# EAGLE design m_knife_1 (EAGLE 7.7.0)
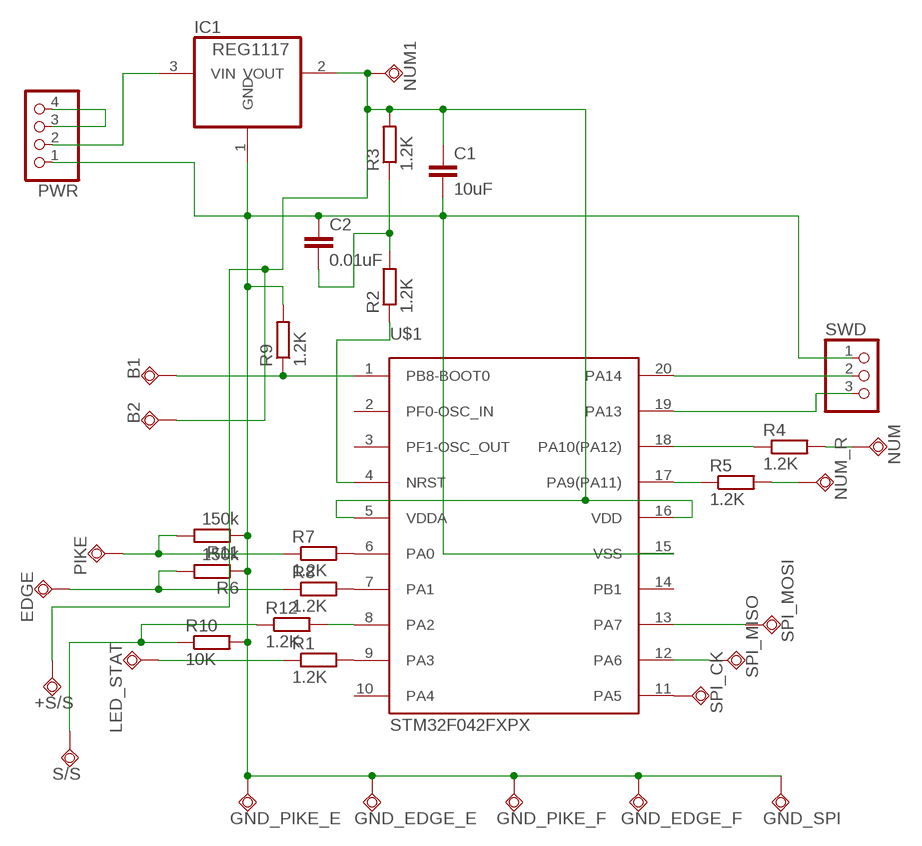
[diagram p0: schematic, sheet 1]

## Parts
+S/S  TPSQTP20R  [TP20R]
B1  TPSQTP20R  [TP20R]
B2  TPSQTP20R  [TP20R]
C1  10uF  C-EUC0805  [C0805]
C2  0.01uF  C-EUC0805  [C0805]
EDGE  TPSQTP20R  [TP20R]
GND_EDGE_E  TPSQTP20R  [TP20R]
GND_EDGE_F  TPSQTP20R  [TP20R]
GND_PIKE_E  TPSQTP20R  [TP20R]
GND_PIKE_F  TPSQTP20R  [TP20R]
GND_SPI  TPSQTP20R  [TP20R]
IC1  REG1117  [SOT223]
LED_STAT  TPSQTP20R  [TP20R]
NUM  TPSQTP20R  [TP20R]
NUM1  TPSQTP20R  [TP20R]
NUM_R  TPSQTP20R  [TP20R]
PIKE  TPSQTP20R  [TP20R]
PWR  PINHD-1X4  [1X04]
R1  1.2K  R-EU_R0805  [R0805]
R2  1.2K  R-EU_R0805  [R0805]
R3  1.2K  R-EU_R0805  [R0805]
R4  1.2K  R-EU_R0805  [R0805]
R5  1.2K  R-EU_R0805  [R0805]
R6  150k  R-EU_R0805  [R0805]
R7  1.2K  R-EU_R0805  [R0805]
R8  1.2K  R-EU_R0805  [R0805]
R9  1.2K  R-EU_R0805  [R0805]
R10  10K  R-EU_R0805  [R0805]
R11  150k  R-EU_R0805  [R0805]
R12  1.2K  R-EU_R0805  [R0805]
S/S  TPSQTP20R  [TP20R]
SPI_CK  TPSQTP20R  [TP20R]
SPI_MISO  TPSQTP20R  [TP20R]
SPI_MOSI  TPSQTP20R  [TP20R]
SWD  PINHD-1X3  [1X03]
U$1  STM32F042FXPX  [TSSOP20]

## Nets
N$1: R7.2 U$1.6(PA0)
N$2: R8.2 U$1.7(PA1)
N$3: R1.2 U$1.9(PA3)
N$4: SPI_CK.TP U$1.11(PA5)
N$5: SPI_MISO.TP U$1.12(PA6)
N$6: SPI_MOSI.TP U$1.13(PA7)
N$7: R4.1 U$1.18(PA10(PA12))
N$8: R12.2 U$1.8(PA2)
N$9: NUM_R.TP R5.2
N$10: R10.1 R12.1 S/S.TP
N$11: R2.1 U$1.4(NRST)
N$12: B1.TP R9.1 U$1.1(PB8-BOOT0)
N$13: LED_STAT.TP R1.1
N$14: C1.2 C2.1 GND_EDGE_E.TP GND_EDGE_F.TP GND_PIKE_E.TP GND_PIKE_F.TP GND_SPI.TP IC1.1(GND) PWR.1 R6.1 R9.2 R10.2 R11.1 SWD.1 U$1.15(VSS)
N$15: PWR.3 PWR.4
N$16: IC1.3(VIN) PWR.2
N$18: NUM.TP R4.2
N$19: SWD.2 U$1.20(PA14)
N$20: SWD.3 U$1.19(PA13)
N$21: C2.2 R2.2 R3.1
N$22: R5.1 U$1.17(PA9(PA11))
N$24: PIKE.TP R7.1 R11.2
N$25: EDGE.TP R6.2 R8.1
N$27: +S/S.TP B2.TP C1.1 IC1.2(VOUT) NUM1.TP R3.2 U$1.5(VDDA) U$1.16(VDD)
Unconnected: U$1.2(PF0-OSC_IN) U$1.3(PF1-OSC_OUT) U$1.10(PA4) U$1.14(PB1)

## Library data of the parts
+S/S B1 B2 EDGE GND_EDGE_E GND_EDGE_F GND_PIKE_E GND_PIKE_F GND_SPI LED_STAT NUM NUM1 NUM_R PIKE S/S SPI_CK SPI_MISO SPI_MOSI = testpad:TPSQ: Test pad
C1 C2 = rcl:C-EU: CAPACITOR, European symbol
IC1 = burr-brown:REG1117: 800mA and 1A Low Dropout (LDO) Positive Regulator 1.8V, 2.5V, 2.85V, 3.3V, 5V, and Adj; MPN: REG1117; OC_FARNELL: 1097566; OC_NEWARK: 14P6981
PWR = pinhead:PINHD-1X4: PIN HEADER
R1-R12 = resistor:R-EU_: RESISTOR, European symbol
SWD = pinhead:PINHD-1X3: PIN HEADER
U$1 = stm32f0:STM32F042FXPX

## Board
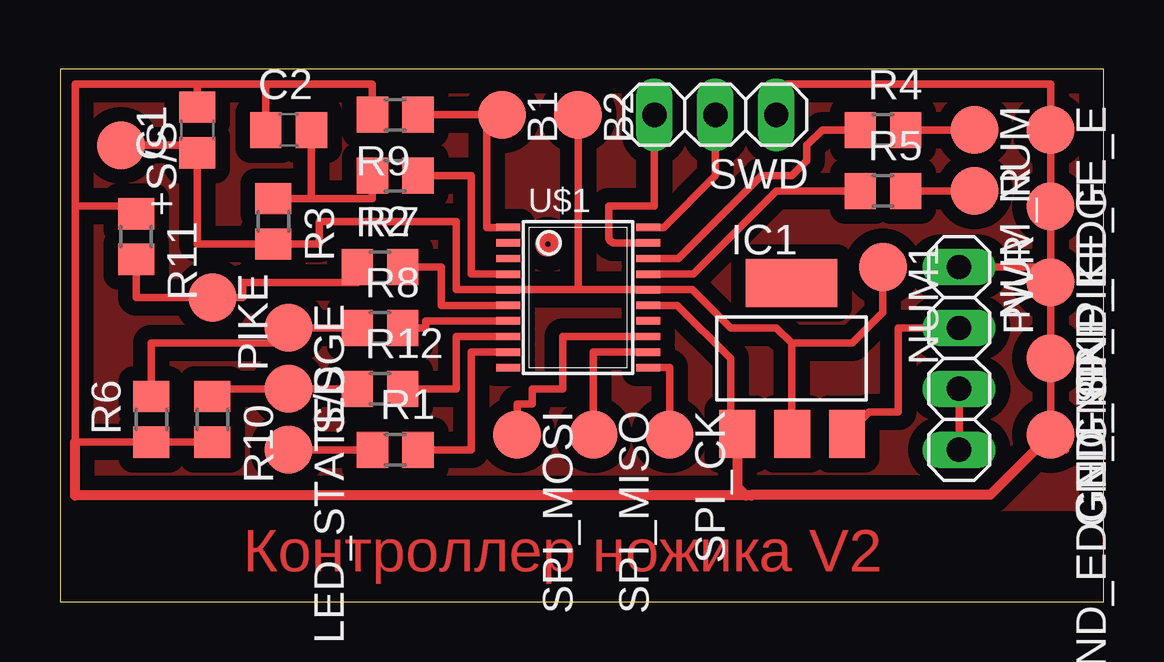
[diagram p1: board, top side]

Size 43.48 x 22.21 mm. Coordinates in mm from the lower left corner, seen from the top.
Outline: 0,22.21 0,0 43.48,0 43.48,22.21 0,22.21
Copper layers (1*16): Top 0.035mm / dielectric 1.5mm / Bottom 0.035mm
Design rules "default *": minimum track width 10mil, minimum drill 24mil, track to track 8mil, track to pad 8mil, pad to pad 8mil, via to via 8mil, smd to smd 8mil, copper to edge 40mil, drill to drill 8mil, minimum pad ring 10mil, minimum via ring 8mil, stop-mask expansion 4mil, vias tented up to drill 0mil, thermal gap 10mil

### Footprints (pad centres in the part's own frame; a part is rotated, then mirrored left to right if it is on the bottom)
TP20R = smd 2 x 2: TP 0,0
C0805 = smd 1.3 x 1.5: 1 -0.95,0; 2 0.95,0
SOT223 = smd 1.499 x 2.007: 1 -2.261,-3.15; 2 0.025,-3.15; 3 2.311,-3.15 | smd 3.81 x 2.007: 4 0,3.15
1X04 = drill 1.016 long: 1 -3.81,0; 2 -1.27,0; 3 1.27,0; 4 3.81,0
R0805 = smd 1.3 x 1.5: 1 -0.95,0; 2 0.95,0
1X03 = drill 1.016 long: 1 -2.54,0; 2 0,0; 3 2.54,0
TSSOP20 = smd 0.305 x 0.991: 1 -2.925,-2.918; 2 -2.275,-2.918; 3 -1.625,-2.918; 4 -0.975,-2.918; 5 -0.325,-2.918; 6 0.325,-2.918; 7 0.975,-2.918; 8 1.625,-2.918; 9 2.275,-2.918; 10 2.925,-2.918; 11 2.925,2.918; 12 2.275,2.918; 13 1.625,2.918; 14 0.975,2.918; 15 0.325,2.918; 16 -0.325,2.918; 17 -0.975,2.918; 18 -1.625,2.918; 19 -2.275,2.918; 20 -2.925,2.918

### Placement (x,y rotation side)
+S/S  2.54,19.03 270 top
B1  18.41,20.3 270 top
B2  21.59,20.3 270 top
C1  5.71,19.66 90 top
C2  9.53,19.66 0 top
EDGE  9.53,11.41 270 top
GND_EDGE_E  41.27,19.66 270 top
GND_EDGE_F  41.27,6.97 270 top
GND_PIKE_E  41.27,13.32 270 top
GND_PIKE_F  41.27,16.49 270 top
GND_SPI  41.27,10.14 270 top
IC1  30.48,10.14 0 top
LED_STAT  9.53,6.33 270 top
NUM  38.1,19.66 270 top
NUM1  34.29,13.95 270 top
NUM_R  38.1,17.12 270 top
PIKE  6.35,12.68 270 top
PWR  37.47,10.14 270 top
R1  13.97,6.33 0 top
R2  13.97,17.76 180 top
R3  8.89,15.86 270 top
R4  34.29,19.66 0 top
R5  34.29,17.12 0 top
R6  3.81,7.6 90 top
R7  13.34,13.95 0 top
R8  13.34,11.41 0 top
R9  13.97,20.3 180 top
R10  6.35,7.6 270 top
R11  3.17,15.22 270 top
R12  13.34,8.87 0 top
S/S  9.53,8.87 270 top
SPI_CK  25.4,6.97 270 top
SPI_MISO  22.23,6.97 270 top
SPI_MOSI  19.05,6.97 270 top
SWD  27.3,20.3 180 top
U$1  21.59,12.68 270 top

### Tracks (layer width: path | path; a pad name or v marks a point on that pad's centre or on a via)
N$1
  Top 0.305: U$1.6 15.88,12.36 15.88,13.95 R7.2
N$2
  Top 0.305: U$1.7 15.24,11.71 15.24,11.41 R8.2
N$3
  Top 0.305: U$1.9 17.14,10.41 17.14,6.33 R1.2
N$4
  Top 0.305: U$1.11 25.4,9.76 SPI_CK.TP
N$5
  Top 0.305: U$1.12 22.23,10.41 SPI_MISO.TP
N$6
  Top 0.305: U$1.13 20.95,11.05 20.95,8.87 19.68,8.87 19.68,8.24 19.05,8.24 SPI_MOSI.TP
N$7
  Top 0.305: U$1.18 25.75,14.3 29.21,17.76 30.48,17.76 31.11,18.39 31.11,19.03 31.75,19.66 R4.1
N$8
  Top 0.305: U$1.8 16.51,11.05 16.51,8.87 R12.2
N$9
  Top 0.305: R5.2 NUM_R.TP
N$10
  Top 0.305: R12.1 S/S.TP 6.35,8.87 R10.1
N$11
  Top 0.305: U$1.4 17.14,13.66 17.14,17.76 R2.1
N$12
  Top 0.305: U$1.1 17.78,15.61 17.78,20.3 | 17.78,20.3 R9.1 | B1.TP 17.78,20.3
N$13
  Top 0.305: R1.1 LED_STAT.TP
N$14
  Top 0.305: 0.64,16.49 0.64,6.65 R6.1 R10.2 | 0.64,16.49 0.64,21.57 5.71,21.57 | C1.2 5.71,21.57 | R9.2 13.02,21.57 8.57,21.57 | 8.57,21.57 5.71,21.57 | C2.1 8.57,21.57 | R11.1 3.17,16.49 0.64,16.49 | U$1.15 25.73,12.36 27.94,10.14 27.94,7.91 IC1.1 | GND_PIKE_E.TP GND_PIKE_F.TP GND_EDGE_E.TP 41.27,21.57 29.84,21.57 SWD.1 | GND_PIKE_E.TP GND_SPI.TP GND_EDGE_F.TP 41.91,6.33 | 28.85,4.46 28.82,4.43 | PWR.1 40.64,13.95 GND_PIKE_E.TP
  Top 0.406: 28.82,4.43 28.57,4.43 | 28.57,4.43 0.64,4.43 0.64,6.65 | 28.85,4.46 38.77,4.46 GND_EDGE_F.TP | IC1.1 28.22,4.78 28.57,4.43
N$15
  Top 0.305: PWR.3 PWR.4
N$16
  Top 0.305: PWR.2 34.92,11.41 34.92,7.92 33.72,7.92 IC1.3
N$18
  Top 0.305: R4.2 NUM.TP
N$19
  Top 0.305: SWD.2 27.3,17.76 25.15,15.61 U$1.20
N$20
  Top 0.305: SWD.3 24.77,16.49 22.86,16.49 22.86,15.22 arc90 23.12,14.96 U$1.19
N$21
  Top 0.305: R2.2 13.02,16.8 10.47,16.8 | 10.47,16.8 R3.1 | C2.2 10.47,16.8
N$22
  Top 0.305: U$1.17 26.38,13.66 29.84,17.12 R5.1
N$23
  pour Top (isolate 0.61): 0,22.21 0,3.79 43.18,3.79 43.18,22.21
N$24
  Top 0.305: R7.1 12.38,13.32 7.62,13.32 7.62,12.68 PIKE.TP 3.17,12.68 R11.2
N$25
  Top 0.305: R8.1 EDGE.TP 9.53,10.78 3.81,10.78 R6.2
N$27
  Top 0.305: 21.59,13.01 U$1.5 16.51,13.01 16.51,15.86 10.79,15.86 10.79,14.91 R3.2 5.71,14.91 C1.1 5.71,19.03 +S/S.TP | 21.59,13.01 U$1.16 26.34,13.01 27.94,11.41 29.84,11.41 30.48,10.78 | B2.TP 21.59,13.01 | 30.48,10.78 30.48,7.65 IC1.2 | NUM1.TP 34.29,12.04 33.02,10.78 30.48,10.78
(copper drawn outside any net)
  shapes: Top circle x1

### Text on the board
Top: Контроллер ножика V2